# EAGLE design Leistungsstufe (EAGLE 9.7.0)
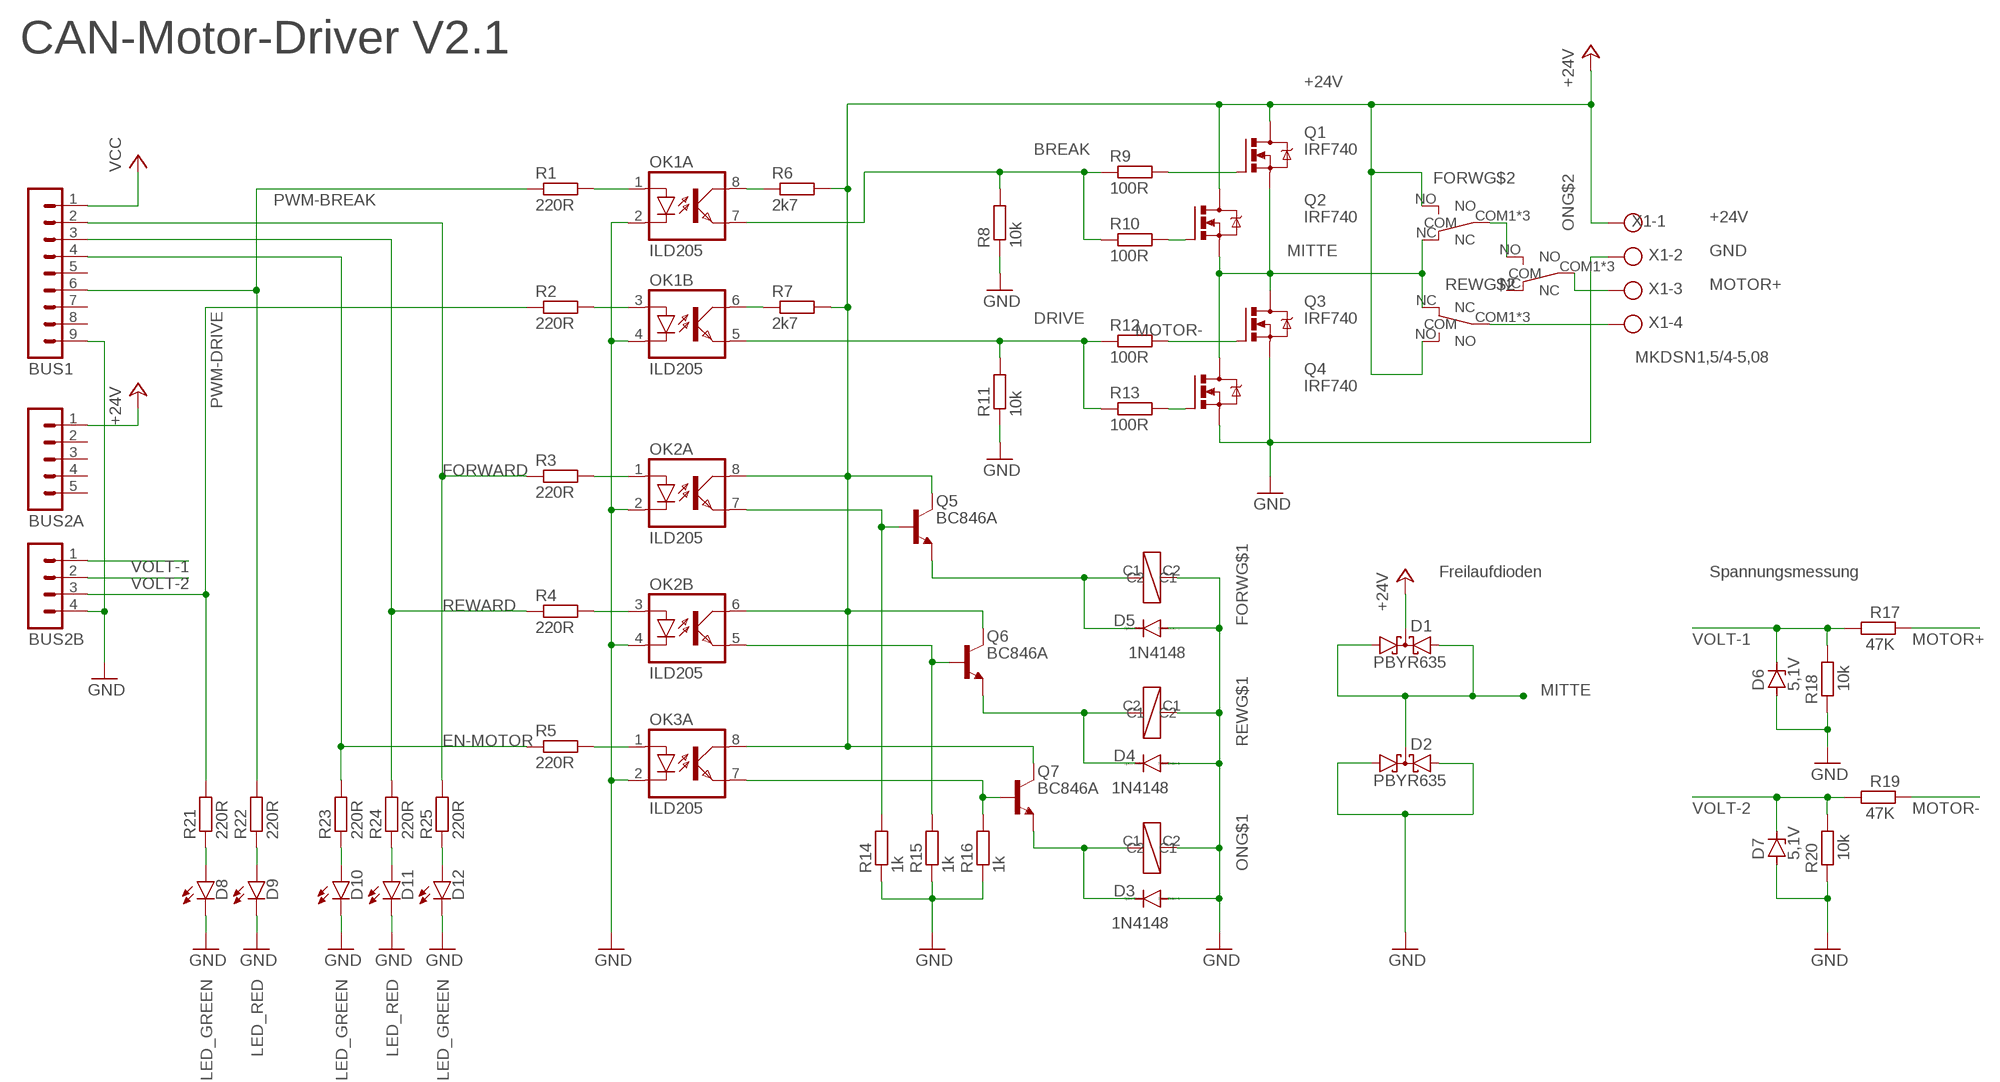
[diagram p0: schematic, sheet 1]

## Parts
BUS1  MA09-1  [MA09-1]
BUS2A  MA05-1  [MA05-1]
BUS2B  MA04-1  [MA04-1]
D1  PBYR635  [SOT82S]
D2  PBYR635  [SOT82S]
D3  1N4148  DIODE-SOD323-R  [SOD323-R]
D4  1N4148  DIODE-SOD323-R  [SOD323-R]
D5  1N4148  DIODE-SOD323-R  [SOD323-R]
D6  5,1V  ZENER-DIODESOD80C  [SOD80C]
D7  5,1V  ZENER-DIODESOD80C  [SOD80C]
D8  LED_GREEN  LED_CHIP_GREEN-1608  [LEDC1608X39N_G]
D9  LED_RED  LED_CHIP_RED-1608  [LEDC1608X39N_R]
D10  LED_GREEN  LED_CHIP_GREEN-1608  [LEDC1608X39N_G]
D11  LED_RED  LED_CHIP_RED-1608  [LEDC1608X39N_R]
D12  LED_GREEN  LED_CHIP_GREEN-1608  [LEDC1608X39N_G]
FORW  FRA2C-2  [FRA2C-2]
OK1  ILD205  [SOIC08]
OK2  ILD205  [SOIC08]
OK3  ILD205  [SOIC08]
ON  FRA2C-2  [FRA2C-2]
Q1  IRF740  [TO220BV]
Q2  IRF740  [TO220BV]
Q3  IRF740  [TO220BV]
Q4  IRF740  [TO220BV]
Q5  BC846A  NPN_BC846A,215_SOT23-BEC  [SOT95P237X112-3N]
Q6  BC846A  NPN_BC846A,215_SOT23-BEC  [SOT95P237X112-3N]
Q7  BC846A  NPN_BC846A,215_SOT23-BEC  [SOT95P237X112-3N]
R1  220R  R-EU_R0805  [R0805]
R2  220R  R-EU_R0805  [R0805]
R3  220R  R-EU_R0805  [R0805]
R4  220R  R-EU_R0805  [R0805]
R5  220R  R-EU_R0805  [R0805]
R6  2k7  R-EU_R0805  [R0805]
R7  2k7  R-EU_R0805  [R0805]
R8  10k  R-EU_R0805  [R0805]
R9  100R  R-EU_R0805  [R0805]
R10  100R  R-EU_R0805  [R0805]
R11  10k  R-EU_R0805  [R0805]
R12  100R  R-EU_R0805  [R0805]
R13  100R  R-EU_R0805  [R0805]
R14  1k  R-EU_R0805  [R0805]
R15  1k  R-EU_R0805  [R0805]
R16  1k  R-EU_R0805  [R0805]
R17  47K  R-EU_MELF0102W  [MINI_MELF-0102W]
R18  10k  R-EU_MELF0102W  [MINI_MELF-0102W]
R19  47K  R-EU_MELF0102W  [MINI_MELF-0102W]
R20  10k  R-EU_MELF0102W  [MINI_MELF-0102W]
R21  220R  R-EU_R0805  [R0805]
R22  220R  R-EU_R0805  [R0805]
R23  220R  R-EU_R0805  [R0805]
R24  220R  R-EU_R0805  [R0805]
R25  220R  R-EU_R0805  [R0805]
REW  FRA2C-2  [FRA2C-2]
X1  MKDSN1,5/4-5,08  [MKDSN1,5/4-5,08]

## Nets
+24V: BUS2A.1 D1.C FORW.NO OK2.6(B:COL) OK2.8(A:COL) OK3.8(A:COL) Q1.D Q2.D Q5.3(C) Q6.3(C) Q7.3(C) R6.2 R7.2 REW.NO X1.1
BREAK: OK1.7(A:EMIT) R8.2 R9.1 R10.1
DRIVE: OK1.5(B:EMIT) R11.2 R12.1 R13.1
EN-MOTOR: BUS1.4 R5.1 R23.2
FORWARD: BUS1.2 R3.1 R25.2
GND: BUS1.9 BUS2B.4 D2.A1 D2.A2 D3.A D4.A D5.A D6.A D7.A D8.1(C) D9.1(C) D10.1(C) D11.1(C) D12.1(C) FORW.C2 OK1.2(A:C) OK1.4(B:C) OK2.2(A:C) OK2.4(B:C) OK3.2(A:C) ON.C2 Q3.S Q4.S R8.1 R11.1 R14.1 R15.1 R16.1 R18.1 R20.1 REW.C1 X1.2
M+SWITCH: FORW.COM1(COM) FORW.COM2(COM) FORW.COM3(COM) ON.NO
MITTE: D1.A1 D1.A2 D2.C FORW.NC Q1.S Q2.S Q3.D Q4.D REW.NC
MOTOR+: ON.COM1(COM) ON.COM2(COM) ON.COM3(COM) R17.2 X1.3
MOTOR-: R19.2 REW.COM1(COM) REW.COM2(COM) REW.COM3(COM) X1.4
N$1: Q2.G R10.2
N$2: Q3.G R12.2
N$3: Q4.G R13.2
N$4: OK2.7(A:EMIT) Q5.1(B) R14.2
N$5: Q1.G R9.2
N$6: OK1.3(B:A) R2.2
N$7: D4.C Q6.2(E) REW.C2
N$8: D8.2(A) R21.1
N$9: D5.C FORW.C1 Q5.2(E)
N$10: OK2.5(B:EMIT) Q6.1(B) R15.2
N$11: D3.C ON.C1 Q7.2(E)
N$12: OK1.8(A:COL) R6.1
N$13: OK1.6(B:COL) R7.1
N$14: OK1.1(A:A) R1.2
N$15: OK2.1(A:A) R3.2
N$16: OK2.3(B:A) R4.2
N$17: OK3.1(A:A) R5.2
N$18: OK3.7(A:EMIT) Q7.1(B) R16.2
N$21: D10.2(A) R23.1
N$23: D9.2(A) R22.1
N$24: D11.2(A) R24.1
N$25: D12.2(A) R25.1
PWM-BREAK: BUS1.6 R1.1 R22.2
PWM-DRIVE: BUS2B.3 R2.1 R21.2
REWARD: BUS1.3 R4.1 R24.2
VCC: BUS1.1
VOLT-1: BUS2B.1 D6.C R17.1 R18.2
VOLT-2: BUS2B.2 D7.C R19.1 R20.2
Unconnected: BUS1.5 BUS1.7 BUS1.8 BUS2A.2 BUS2A.3 BUS2A.4 BUS2A.5 OK3.3(B:A) OK3.4(B:C) OK3.5(B:EMIT) OK3.6(B:COL) ON.NC

## Notes on the sheet
- CAN-Motor-Driver V2.1
- Freilaufdioden | Spannungsmessung

## Library data of the parts
BUS1 = con-lstb:MA09-1: PIN HEADER; OC_FARNELL: unknown; OC_NEWARK: unknown
BUS2A = con-lstb:MA05-1: PIN HEADER; OC_FARNELL: unknown; OC_NEWARK: unknown
BUS2B = con-lstb:MA04-1: PIN HEADER; OC_FARNELL: unknown; OC_NEWARK: unknown
D1 D2 = diode:PBYR635: Dual DIODE common cathode
D3-D5 = diode:DIODE-: DIODE
D6 D7 = diode:ZENER-DIODE: Z-Diode
D8 D10 D12 = Opto-Electronic:LED_CHIP: LED - Generic; CATEGORY: Opto-Electronic; COLOR: Green; SUB-CATEGORY: LED
D9 D11 = Opto-Electronic:LED_CHIP: LED - Generic; CATEGORY: Opto-Electronic; COLOR: Red; SUB-CATEGORY: LED
FORW ON REW = relais_auto:FRA2C-2
OK1-OK3 = optocoupler:ILD2*: Siemens ILD205/206/207/211/213/217 DUAL PHOTOTRANSISTOR SMALL OUTLINE SURFACE MOUNT OPTOCOUPLER Source: 153385-da-01-en-Optocoupler_ILD205-T.pdf; MF: VISHAY/TELEFUNKEN; MPN: ILD205T; OC_FARNELL: 1469512; OC_NEWARK: 20H8678
Q1-Q4 = transistor-power:IRF740: N-CHANNEL MOS FET
Q5-Q7 = Transistor:NPN_: NPN - Popular parts; CATEGORY: Transistor; DESCRIPTION: TRANS NPN 65V 0.1A SOT23; MANUFACTURER: Nexperia USA Inc.; SUB-CATEGORY: BJT; TYPE: NPN
R1-R25 = rcl:R-EU_: RESISTOR, European symbol; SPICEPREFIX: R
X1 = con-phoenix-508:MKDSN1,5/4-5,08: MKDSN 1,5/ 4-5,08 Printklemme Nennstrom: 13,5 A Nennspannung: 250 V Rastermaß: 5,08 mm Polzahl: 4 Anschlussart: Schraubanschluss Montage: Löten Anschlussrichtung Leiter/Platine: 0 ° Artikelnummer: 1729144 Source: http://eshop.phoenixcontact.com .. 1729144.pdf

## Board
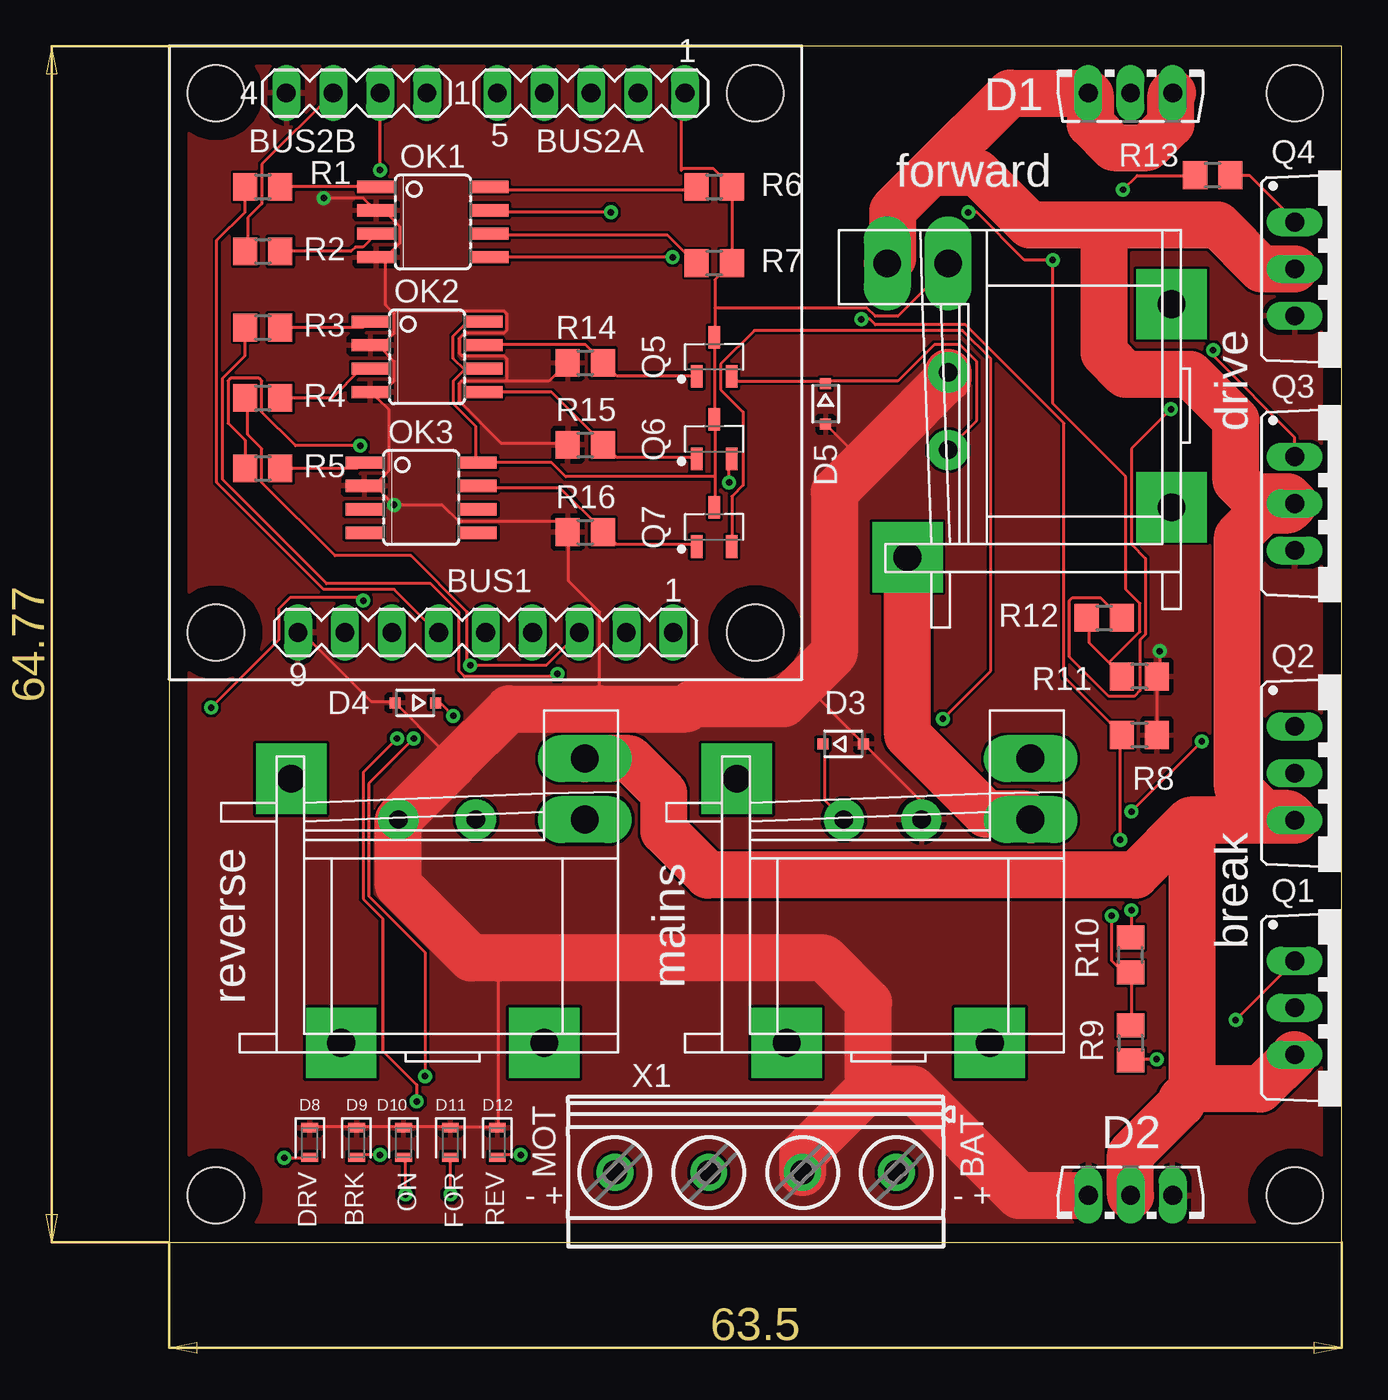
[diagram p1: board, top side]
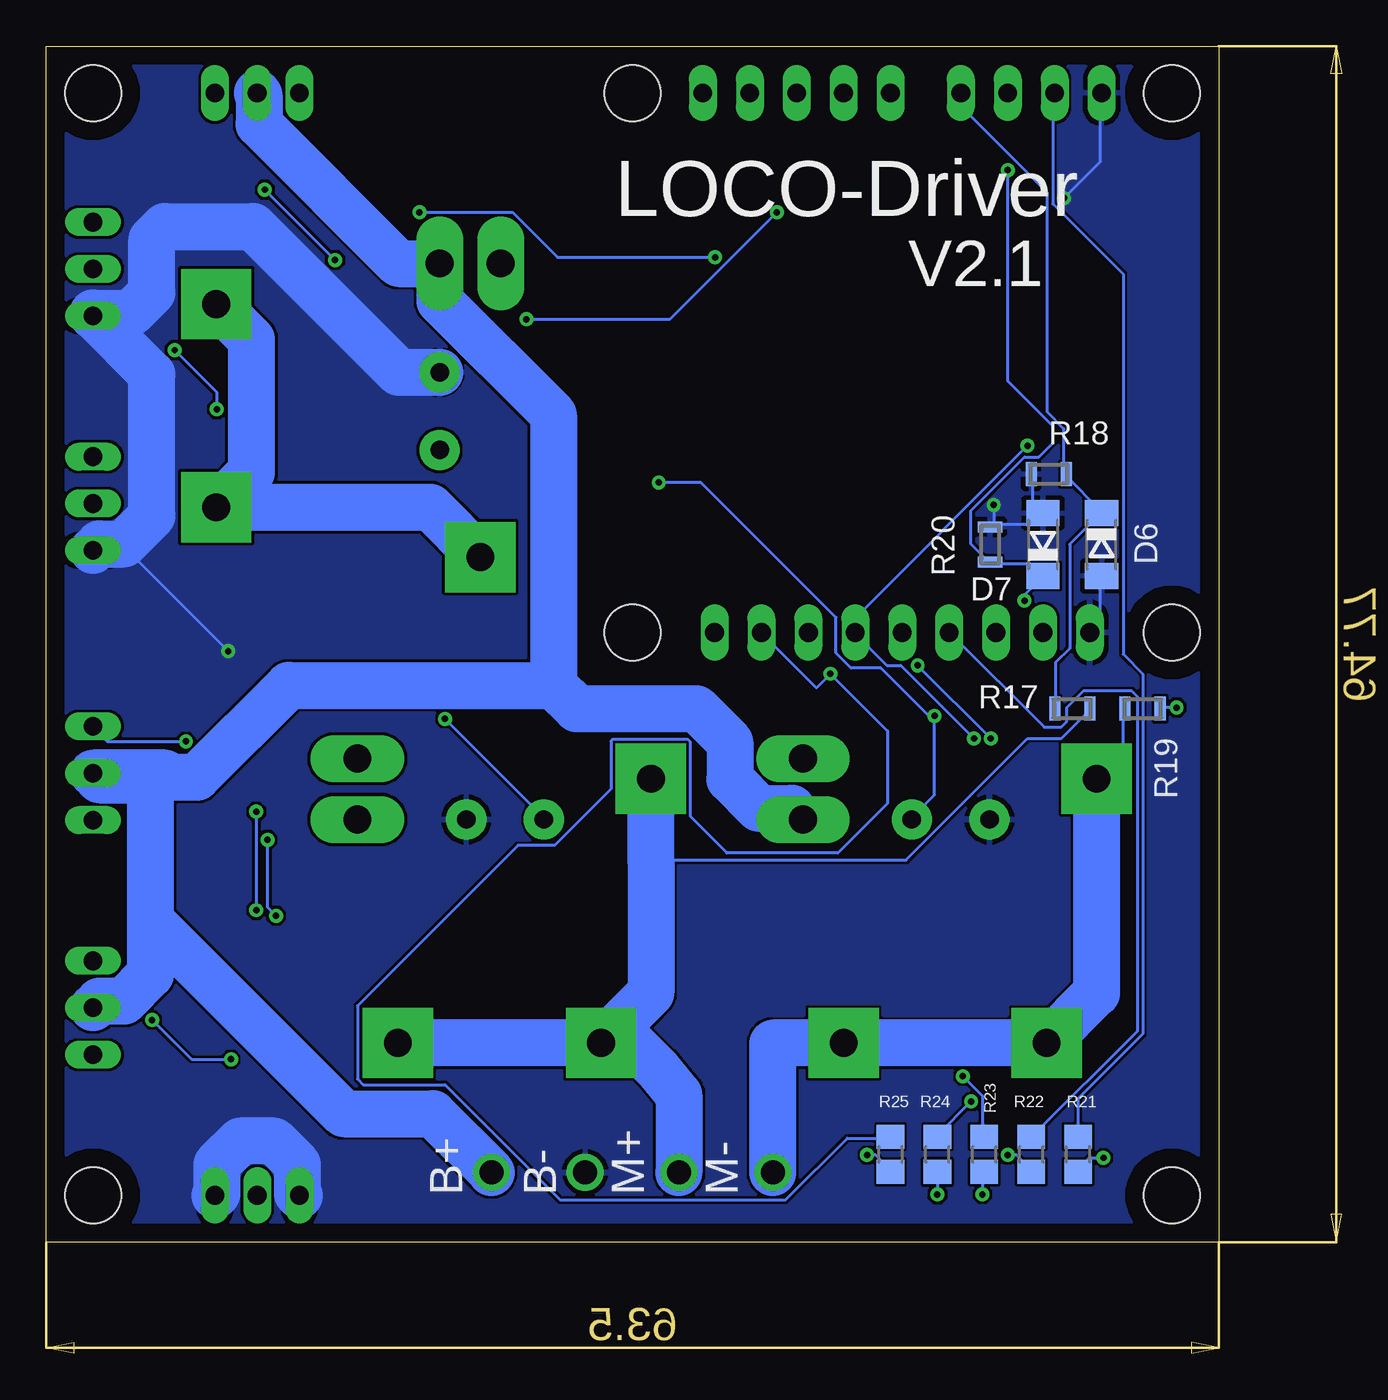
[diagram p2: board, bottom side, seen from below]

Size 63.5 x 64.77 mm. Coordinates in mm from the lower left corner, seen from the top.
Outline: 0,0 63.5,0 63.5,64.77 0,64.77 0,0
Copper layers (1*16): Top / Bottom
Stack-up Default Layer Stack: Top User Defined 0.035mm / Dielectric-1 User Defined 1.5mm / Bottom User Defined 0.035mm
Design rules "default": minimum track width 6mil, minimum drill 0.35mm, track to track 6mil, track to pad 6mil, pad to pad 6mil, via to via 6mil, smd to smd 6mil, copper to edge 40mil, drill to drill 6mil, minimum pad ring 10mil, minimum via ring 8mil, stop-mask expansion 4mil, vias tented up to drill 0mil, thermal gap 10mil
Holes 3.05 mm at 2.54,33.02 31.75,33.02 31.75,62.23 2.54,62.23 2.54,2.54 60.96,2.54 60.96,62.23

### Footprints (pad centres in the part's own frame; a part is rotated, then mirrored left to right if it is on the bottom)
MA09-1 = drill 1.016 long: 1 -10.16,0; 2 -7.62,0; 3 -5.08,0; 4 -2.54,0; 5 0,0; 6 2.54,0; 7 5.08,0; 8 7.62,0; 9 10.16,0
MA05-1 = drill 1.016 long: 1 -5.08,0; 2 -2.54,0; 3 0,0; 4 2.54,0; 5 5.08,0
MA04-1 = drill 1.016 long: 1 -3.81,0; 2 -1.27,0; 3 1.27,0; 4 3.81,0
SOT82S = drill 1.016 long: A1 -2.286,-1.27; A2 2.286,-1.27; C 0,-1.27
SOD323-R = smd 0.6 x 0.6: A 1.1,0; C -1.1,0
SOD80C = smd 1.4 x 1.8: A 1.7,0; C -1.7,0
LEDC1608X39N_G = smd 0.512 x 0.912: 1 -0.8,0; 2 0.8,0
LEDC1608X39N_R = smd 0.512 x 0.912: 1 -0.8,0; 2 0.8,0
FRA2C-2 = drill 1 pad 2.184: C1 -7.9,12.1; C2 -3.7,12.1 | drill 1.5 pad 3.81 square: COM1 0,0; COM2 -11,0; COM3 -13.7,14.3 | drill 1.5 pad 2.54 long: NC 2.2,15.4; NO 2.2,12.1
SOIC08 = smd 0.66 x 2.032: 1 -1.905,-3.073; 2 -0.635,-3.073; 3 0.635,-3.073; 4 1.905,-3.073; 5 1.905,3.073; 6 0.635,3.073; 7 -0.635,3.073; 8 -1.905,3.073
TO220BV = drill 1.016 long: D 0,-2.54; G -2.54,-2.54; S 2.54,-2.54
SOT95P237X112-3N = smd 1.224 x 0.625: 1 -1.064,0.95; 2 -1.064,-0.95; 3 1.064,0
R0805 = smd 1.3 x 1.5: 1 -0.95,0; 2 0.95,0
MINI_MELF-0102W = smd 0.6 x 1.3: 1 -0.95,0; 2 0.95,0
MKDSN1,5/4-5,08 = drill 1.3 pad 2: 1 -7.641,0.025; 2 -2.561,0.025; 3 2.519,0.025; 4 7.599,0.025

### Placement (x,y rotation side)
BUS1  17.14,33.02 180 top
BUS2A  22.86,62.23 180 top
BUS2B  10.16,62.23 180 top
D1  52.07,63.5 0 top
D2  52.07,1.27 180 top
D3  36.51,26.99 0 top
D4  13.34,29.21 180 top
D5  35.56,45.4 270 top
D6  6.35,37.78 270 bottom
D7  9.53,37.78 90 bottom
D8  7.62,5.4 270 top
D9  10.16,5.4 270 top
D10  12.7,5.4 270 top
D11  15.24,5.4 270 top
D12  17.78,5.4 270 top
FORW  54.29,50.8 90 top
OK1  14.29,55.24 270 top
OK2  13.97,47.94 270 top
OK3  13.65,40.32 270 top
ON  44.45,10.79 0 top
Q1  63.5,12.7 270 top
Q2  63.5,25.4 270 top
Q3  63.5,40.01 270 top
Q4  63.5,52.7 270 top
Q5  29.53,47.94 90 top
Q6  29.53,43.5 90 top
Q7  29.53,38.73 90 top
R1  5.08,57.15 0 top
R2  5.08,53.66 0 top
R3  5.08,49.53 0 top
R4  5.08,45.72 0 top
R5  5.08,41.91 0 top
R6  29.53,57.15 0 top
R7  29.53,53.02 0 top
R8  52.55,27.46 180 top
R9  52.07,10.79 270 top
R10  52.07,15.56 90 top
R11  52.55,30.64 180 top
R12  50.64,33.81 0 top
R13  56.52,57.78 0 top
R14  22.54,47.62 0 top
R15  22.54,43.18 0 top
R16  22.54,38.46 0 top
R17  7.94,28.89 0 bottom
R18  9.21,41.59 0 bottom
R19  4.13,28.89 180 bottom
R20  12.38,37.78 270 bottom
R21  7.62,4.76 90 bottom
R22  10.16,4.76 90 bottom
R23  12.7,4.76 90 bottom
R24  15.24,4.76 90 bottom
R25  17.78,4.76 90 bottom
REW  20.32,10.79 0 top
X1  31.75,3.81 180 top

### Tracks (layer width: path | path; a pad name or v marks a point on that pad's centre or on a via)
+24V
  Top 0.152: 16,47.24 15.39,46.63 15.39,45.41 16.61,44.2 16.61,42.37 OK3.8 16.76,42.22 20.73,42.22 21.49,41.45 29.57,41.45 | 16,47.24 16.92,47.24 OK2.6 | 16,47.24 15.39,47.85 15.39,49.07 16.15,49.84 16.92,49.84 OK2.8 | 29.57,41.45 29.57,44.5 Q6.3 29.57,44.65 29.57,48.92 Q5.3 29.57,49.07 29.57,50.6 | 29.57,41.45 29.57,39.93 Q7.3 | BUS2A.1 27.74,62.03 27.74,58.06 27.75,58.05 27.83,58.13 29.5,58.13 R6.2 30.48,53.03 R7.2 30.33,52.88 29.57,52.12 29.57,50.6 | 29.57,50.6 37.8,50.6 38.25,50.14 39.47,50.14 42.22,52.88 FORW.NO
  Bottom 2.54: X1.1 42.57,6.96 47.39,6.96 57.85,17.43 | Q1.D 60.6,13.06 59.29,13.06 57.85,14.49 57.85,17.43 | 57.85,17.43 57.85,25.04 60.6,25.04 Q2.D 57.05,25.4 56.83,25.17 55.34,25.17 50.35,30.16 36.04,30.16 | 36.04,30.16 36.03,30.14 36.03,44.81 42.19,50.97 FORW.NO 44.41,53 51.97,60.56 51.97,62.13 D1.C | 36.04,30.16 36.02,30.16 34.76,28.89 28.3,28.89 26.48,27.08 26.48,25.08 24.91,23.5 23.13,23.5 REW.NO
BREAK  (via drill 0.35)
  Top 0.152: R9.1 52.12,11.89 52.12,14.59 R10.1 51.66,14.63 51.05,15.24 v51.05,17.68 | v51.51,21.79 51.51,27.43 R8.2 51.51,27.58 48.46,30.63 48.46,44.35 43.13,49.68 38.25,49.68 37.95,49.99 v37.49,49.99 | v23.93,55.78 17.37,55.78 OK1.7
  Bottom 0.152: v51.51,21.79 51.51,18.14 v51.05,17.68 | v23.93,55.78 29.72,49.99 v37.49,49.99
DRIVE  (via drill 0.35)
  Top 0.152: 50.9,31.39 51.51,30.79 R11.2 | 50.9,31.39 49.84,32.46 49.84,33.68 R12.1 | v51.66,57 52.43,57.76 55.47,57.76 R13.1 | 50.9,31.39 52.58,33.07 52.58,34.59 51.82,35.36 51.82,41.45 47.85,45.41 v47.85,53.19 46.33,53.19 43.74,55.78 v43.28,55.78 | v27.28,53.34 OK1.5
  Bottom 0.152: v47.85,53.19 v51.66,57 | v27.28,53.34 35.81,53.34 38.25,55.78 v43.28,55.78
EN-MOTOR  (via drill 0.35)
  Top 0.152: v13.87,8.99 13.87,15.7 10.82,18.75 10.82,24.84 v13.26,27.28 | R5.1 4.12,41.91 4.12,43.43 3.2,44.35 3.2,46.63 3.35,46.79 4.88,46.79 5.03,46.63 5.03,44.96 6.86,43.13 v10.36,43.13
  Bottom 0.152: v13.87,8.99 12.8,7.92 12.8,5.79 R23.2 | v13.26,27.28 17.22,31.24 17.98,31.24 19.66,32.92 BUS1.4 19.66,33.07 19.66,33.83 v10.36,43.13
FORWARD  (via drill 0.35)
  Top 0.152: v21.03,30.79 20.88,30.63 16,30.63 15.7,30.94 15.7,34.14 14.17,35.66 8.53,35.66 2.9,41.3 2.9,46.79 4.12,48.01 4.12,49.53 R3.1
  Bottom 0.152: R25.2 17.83,5.64 20.12,5.64 23.47,2.29 35.66,2.29 41.91,8.53 46.33,8.53 46.63,8.84 46.63,12.8 37.95,21.49 35.97,21.49 32.92,24.54 32.92,27.13 32.82,27.23 28.75,27.23 28.62,27.09 28.62,23.06 26.63,21.08 20.63,21.08 17.94,23.77 17.94,27.69 v21.03,30.79 21.79,30.02 24.69,32.92 BUS1.2
GND  (via drill 0.35)
  Top 0.152: 18.29,46.63 20.57,46.63 21.49,47.55 R14.1 | 18.29,46.63 15.85,46.63 15.7,46.48 15.7,45.57 17.98,43.28 21.49,43.28 R15.1 | 11.73,53.34 OK1.4 | 11.73,53.34 12.5,54.1 12.5,55.02 11.73,55.78 11.28,55.78 OK1.2 11.12,55.93 10.52,56.54 v8.38,56.54 | 11.12,41 10.67,41 OK3.2 11.12,41 | 11.12,41 11.89,41.76 11.89,45.11 11.28,45.72 | 11.28,45.72 10.97,46.02 OK2.4 11.28,45.72 | 11.43,48.46 10.97,48.46 OK2.2 11.43,48.46 | 11.43,48.46 12.19,47.7 12.19,46.63 11.28,45.72 | 11.12,41 v12.19,39.93 14.78,39.93 15.7,39.01 21.03,39.01 21.49,38.56 R16.1 21.64,38.41 21.64,35.81 23.32,34.14 23.32,28.89 | 11.73,53.34 11.73,50.75 12.04,50.44 | 12.04,50.44 12.19,50.29 12.19,49.23 11.43,48.46 | 18.29,46.63 18.29,47.85 18.14,48.01 15.85,48.01 15.7,48.16 15.7,48.92 16,49.23 18.14,49.23 18.29,49.38 18.29,50.29 18.14,50.44 12.04,50.44 | D8.1 7.62,6.25 10.06,6.25 D9.1 10.21,6.25 12.65,6.25 D10.1 12.8,6.25 15.24,6.25 | 15.24,6.25 17.68,6.25 D12.1 17.83,6.25 17.83,15.39 | 15.24,6.25 D11.1 | R8.1 53.49,27.58 R11.1 53.65,30.79 v53.65,32 | 15.34,25.81 14.63,26.82 12.34,29.11 D4.A 12.19,29.26 10.97,29.26 7.32,32.92 7.01,32.92 BUS1.9 | 37.63,42.22 35.66,44.2 D5.A | 34.37,30.25 37.49,27.13 D3.A 37.64,26.98 40.69,23.93 40.69,23.01 ON.C2
  Top 1.27: 49.21,2.54 D2.A2
  Top 2.54: 37.89,8.3 37.89,12.97 35.47,15.39 17.83,15.39 16.37,15.39 12.42,19.34 REW.C1 15.34,25.81 18.41,28.89 23.32,28.89 28.03,28.89 28.32,29.17 33.3,29.17 34.37,30.25 36.04,31.91 36.04,40.63 37.63,42.22 38.98,43.57 42.19,46.78 FORW.C2 | X1.2 34.31,4.72 37.89,8.3 | 37.89,8.3 40.28,8.3 46.04,2.54 49.21,2.54
  Bottom 0.152: 10.21,38.86 9.6,39.47 D7.A | 10.06,40.08 9.6,39.62 D7.A | 10.21,38.86 12.19,38.86 | 12.19,38.86 12.34,38.86 R20.1 12.19,38.86 | 10.21,38.86 D7.A | 10.06,40.08 10.06,41.45 R18.1 | 10.06,40.08 D7.A | v12.19,39.93 12.19,38.86 | v8.38,56.54 6.4,58.52 6.4,62.18 BUS2B.4 | D6.A 6.4,35.97 6.4,33.53 6.86,33.07 BUS1.9 | v53.65,32 58.52,36.88 59.29,37.82
  Bottom 2.54: Q3.S 60.6,37.82 59.29,37.82 57.78,39.33 57.78,46.99 Q4.S 60.96,50.33 58.9,50.32 57.78,51.44 57.78,54.29 57.08,55 52.29,55 44.4,47.1 FORW.C2 | D2.A2 49.89,2.64 49.89,4.21 51.16,5.49 52.98,5.49 54.25,4.21 54.25,2.64 D2.A1
  pour Top: 0,64.77 63.5,64.77 63.5,0 0,0
  pour Bottom: 0,64.77 63.5,64.77 63.5,0 0,0
M+SWITCH
  Top 2.54: ON.NO 46.36,23.18 44.27,23.18 39.99,27.46 FORW.COM3
  Bottom 2.54: FORW.COM1 52.39,48.9 52.39,41.7 FORW.COM2 42.69,39.8 FORW.COM3
MITTE
  Top 2.54: Q1.S 59.09,8.29 55.4,8.29 | 55.4,8.29 55.4,22.86 Q2.S | Q2.S 60.6,23.22 59.29,23.22 57.85,24.65 57.85,38.21 59.29,39.65 60.6,39.65 Q3.D 60.6,40.36 58.66,40.36 57.78,41.24 57.78,44.52 55.3,47 51.8,47 50.64,48.15 50.64,55.08 | Q2.S 55.32,22.86 52.34,19.89 29.19,19.89 26.8,22.27 26.8,24.33 24.93,26.2 REW.NC | 41.24,57.91 43.78,57.91 46.62,55.08 50.64,55.08 | 41.24,57.91 39.18,55.86 39.18,53.29 FORW.NC | Q4.D 59.16,52.7 56.79,55.08 50.64,55.08 | 41.24,57.91 45.56,62.23 D1.A1 49.89,62.13 49.89,60.56 51.16,59.28 52.98,59.28 54.25,60.56 54.25,62.13 D1.A2 | 55.4,8.29 54.82,7.71 54.82,7.51 52.07,4.76 D2.C
MOTOR+
  Bottom 0.152: 30.75,20.7 16.94,20.7 10.36,27.28 8.53,27.28 7.01,28.8 R17.2
  Bottom 2.54: ON.COM3 30.75,20.7 30.75,13.49 ON.COM2 | ON.COM2 ON.COM1 | ON.COM2 31.8,10.79 30.32,9.32 29.23,7.99 X1.3
MOTOR-
  Bottom 0.152: R19.2 5.18,28.8 5.18,26.67 5.79,26.06 REW.COM3
  Bottom 2.54: REW.COM3 6.62,13.49 REW.COM2 REW.COM1 24.13,10.79 24.16,10.77 24.15,10.76 X1.4
N$1  (via drill 0.35)
  Top 0.152: v52.12,17.98 52.12,16.61 R10.2 | v55.93,27.13 v52.12,23.32
  Bottom 0.152: v52.12,23.32 v52.12,17.98 | v55.93,27.13 60.2,27.13 60.96,27.89 Q2.G
N$2  (via drill 0.35)
  Top 0.152: v54.25,45.11 52.12,42.98 52.12,37.8 52.88,37.03 52.88,32.92 52.58,32.61 52.58,29.87 52.27,29.57 50.9,29.57 48.77,31.7 48.77,34.75 48.92,34.9 50.44,34.9 51.51,33.83 R12.2 | v56.54,48.31 56.54,48.01 60.96,43.59 Q3.G
  Bottom 0.152: v54.25,45.11 54.25,46.02 v56.54,48.31
N$3
  Top 0.152: R13.2 57.61,57.76 58.52,57.76 60.96,55.32 Q4.G
N$4
  Top 0.152: Q5.1 28.5,46.94 24.23,46.94 23.62,47.55 R14.2 23.47,47.7 22.55,48.62 17.07,48.62 OK2.7
N$5  (via drill 0.35)
  Top 0.152: v53.49,9.91 52.12,9.91 R9.2 | Q1.G v57.76,12.04
  Bottom 0.152: v53.49,9.91 55.63,9.91 v57.76,12.04
N$6
  Top 0.152: OK1.3 10.5,53.9 10.1,53.9 9.86,53.66 R2.2
N$7  (via drill 0.35)
  Top 0.152: v15.39,28.5 14.78,29.11 14.48,29.11 D4.C | v30.33,41.15 30.33,42.37 Q6.2
  Bottom 0.152: REW.C2 16.61,23.01 15.39,24.23 v15.39,28.5 15.71,28.5 18.3,31.09 19.92,31.09 20.73,31.9 20.73,33.83 28.04,41.15 v30.33,41.15
N$8  (via drill 0.35)
  Top 0.152: v6.25,4.57 7.62,4.57 D8.2
  Bottom 0.152: v6.25,4.57 7.01,4.57 7.62,3.96 R21.1
N$9
  Top 0.152: Q5.2 30.48,46.79 30.63,46.63 35.51,46.63 D5.C 35.66,46.63 39.47,46.63 41.45,48.62 42.82,48.62 43.74,47.7 43.74,44.5 42.22,42.98 FORW.C1
N$10
  Top 0.152: Q6.1 28.5,42.52 24.23,42.52 23.62,43.13 R15.2 23.47,43.28 20.73,46.02 17.07,46.02 OK2.5
N$11  (via drill 0.35)
  Top 0.152: D3.C 35.51,26.98 35.51,23.93 36.42,23.01 ON.C1 | v41.91,28.35 44.5,30.94 44.5,47.85 42.98,49.38 31.7,49.38 29.87,47.55 29.87,46.18 31.09,44.96 31.09,41 30.48,40.39 30.48,37.8 Q7.2
  Bottom 0.152: v41.91,28.35 36.58,23.01 ON.C1
N$12
  Top 0.152: R6.1 28.5,57.15 28.46,57.15 28.04,57.15 27.89,57 17.53,57 17.37,57.15 OK1.8
N$13
  Top 0.152: R7.1 28.5,53.03 26.98,54.56 17.37,54.56 OK1.6
N$14
  Top 0.152: OK1.1 6.1,57.15 R1.2
N$15
  Top 0.152: R3.2 6.1,49.53 10.52,49.53 10.82,49.84 OK2.1
N$16
  Top 0.152: R4.2 6.1,45.72 8.84,45.72 10.36,47.24 10.82,47.24 OK2.3
N$17
  Top 0.152: R5.2 10.21,41.91 10.52,42.22 OK3.1
N$18
  Top 0.152: Q7.1 28.5,37.8 24.23,37.8 23.62,38.41 R16.2 23.47,38.56 21.18,40.84 16.76,40.84 OK3.7
N$21  (via drill 0.35)
  Top 0.152: v12.8,2.59 12.8,4.57 D10.2
  Bottom 0.152: v12.8,2.59 12.8,3.81 R23.1
N$23  (via drill 0.35)
  Top 0.152: v11.43,4.72 10.21,4.72 D9.2
  Bottom 0.152: v11.43,4.72 10.97,4.72 10.21,3.96 R22.1
N$24  (via drill 0.35)
  Top 0.152: v15.24,2.59 D11.2
  Bottom 0.152: R24.1 v15.24,2.59
N$25  (via drill 0.35)
  Top 0.152: v19.05,4.72 17.83,4.72 D12.2
  Bottom 0.152: v19.05,4.72 18.59,4.72 17.83,3.96 R25.1
PWM-BREAK
  Top 0.152: R1.1 4.12,57.15 4.12,55.78 2.59,54.25 2.59,41.15 8.38,35.36 12.19,35.36 14.48,33.07 BUS1.6
  Bottom 0.152: R22.2 10.06,5.79 4.42,11.43 4.42,29.57 4.72,29.87 7.32,29.87 8.23,28.96 8.23,28.19 8.53,27.89 9.45,27.89 14.48,32.92 BUS1.6
PWM-DRIVE
  Top 0.152: BUS2B.3 5.03,58.37 5.03,56.24 4.27,55.47 4.27,53.8 R2.1
  Bottom 0.152: R21.2 7.62,7.77 4.12,11.28 4.12,30.79 5.18,31.85 5.18,52.43 8.99,56.24 8.99,62.18 BUS2B.3
REWARD  (via drill 0.35)
  Top 0.152: v13.41,7.62 13.41,8.53 11.58,10.36 11.58,17.53 10.52,18.59 10.52,25.45 v12.34,27.28 | BUS1.3 22.1,32.92 20.42,31.24 v16.31,31.24 16.15,31.39 16.15,34.14 13.11,37.19 8.99,37.19 5.03,41.15 5.03,42.98 4.27,43.74 4.27,45.72 R4.1
  Bottom 0.152: v13.41,7.62 15.24,5.79 R24.2 | v16.31,31.24 v12.34,27.28
VOLT-1
  Bottom 0.152: 8.38,42.06 8.38,41.6 R18.2 | R17.1 8.84,28.96 8.84,31.39 8.08,32.16 8.08,37.8 6.4,39.47 D6.C 6.4,39.62 8.23,41.45 R18.2 | 8.38,42.06 8.38,44.04 9.3,44.96 9.3,56.84 13.87,61.42 13.87,62.18 BUS2B.1 | 8.38,42.06 R18.2
VOLT-2  (via drill 0.35)
  Top 0.152: v2.29,28.96 5.94,32.61 5.94,34.29 6.55,34.9 10.36,34.9 v10.52,34.75 | v11.43,58.06 BUS2B.2
  Bottom 0.152: 10.21,36.73 9.6,36.12 D7.C | D7.C 9.45,35.97 9.14,35.66 D7.C | v2.29,28.96 3.05,28.96 R19.1 | v10.52,34.75 10.52,35.05 9.6,35.97 D7.C | 10.21,36.73 12.34,36.73 R20.2 12.5,36.88 13.41,37.8 13.41,39.62 10.52,42.52 9.75,42.52 8.99,43.28 8.99,44.2 11.43,46.63 v11.43,58.06 | 10.21,36.73 D7.C

### Text on the board
tNames: forward | drive | break | reverse | mains | DRV | BRK | ON | FOR | REV | MOT | BAT | - + | - +
bNames: LOCO-Driver | V2.1 | M- | M+ | B- | B+